# EAGLE board ModernWoodPCB (EAGLE 9.6.2), part 1 of 2
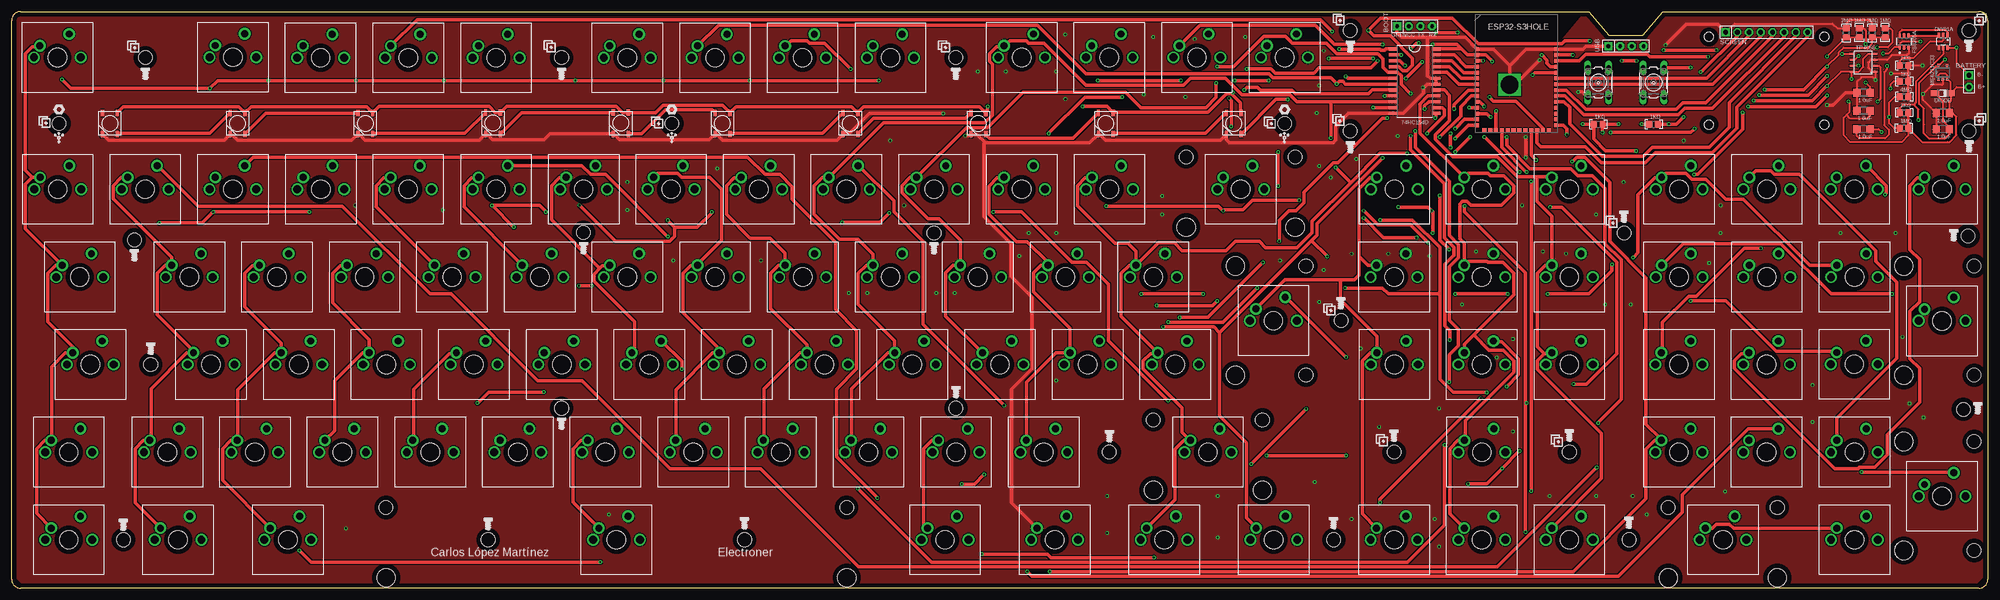
[diagram p2: board, top side]
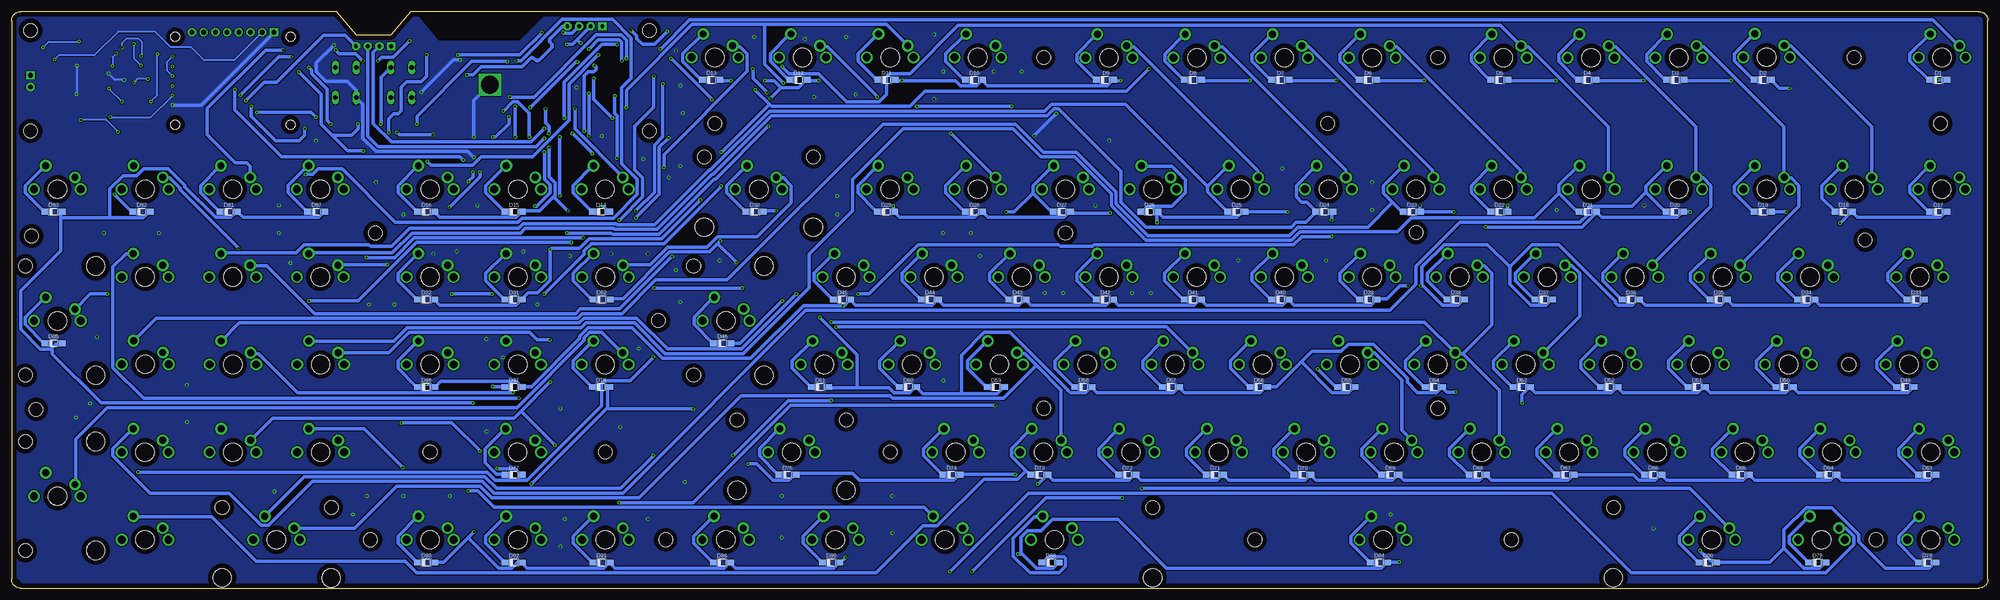
[diagram p3: board, bottom side, seen from below]

Size 428.5 x 125 mm. Coordinates in mm from the lower left corner, seen from the top.
Outline: 342,125 346.35,119.9 353.65,119.9 358,125 426.5,125 arc-90 428.5,123 428.5,2 arc-90 426.5,0 2,0 arc-90 0,2 0,123 arc-90 2,125 342,125
Copper layers (1*16): Top 0.035mm / dielectric 1.5mm / Bottom 0.035mm
Design rules "default *": minimum track width 15mil, minimum drill 0.35mm, track to track 8mil, track to pad 8mil, pad to pad 8mil, via to via 8mil, smd to smd 6mil, copper to edge 40mil, drill to drill 14mil, minimum pad ring 10mil, minimum via ring 8mil, stop-mask expansion 4mil, vias tented up to drill 14mil, thermal gap 10mil
Net classes: 0 default: width 0.203 mm
Holes 3 mm at 81.2,17.5 181.05,17.5 382.82,17.5 359.18,17.5 425.5,31.82 425.5,8.18 425.5,46.18 425.5,69.83 271.2,36.5 247.55,36.5 280.63,46.18 280.62,69.83 278.32,93.5 254.68,93.5 29,115 119.25,115 204.75,115 10.3,100.75 143.15,100.75 276,100.75 290.25,99.12 290.25,120.88 424.38,120.88 424.38,99.12 423.17,38.77 350.66,10.5 337.75,29.5 424.18,76.36 349.63,77 299.75,29.5 288.25,58 286.68,10.5 238,29.5 204.75,39 158.92,10.5 103.33,10.5 24.25,10.5 119.25,39 200,77 124,77.12 26.62,75.5 30.19,48.5
Holes 4 mm at 81.2,2.25 181.07,2.25 382.82,2.25 359.18,2.24 410.24,8.17 410.24,31.82 410.24,46.18 410.25,69.82 271.2,21.25 247.55,21.25 265.37,46.18 265.37,69.83 254.68,78.25 278.32,78.24
Holes 2 mm at 368,119.5 393,119.5 368,100.5 393,100.5
tKeepout: area 317.2,118.5 to 335.3,124.8
bKeepout: area 317.2,118.5 to 335.3,124.8

## Footprints (pad centres in the part's own frame; a part is rotated, then mirrored left to right if it is on the bottom)
SIP-100-02-40 = drill 1.016 pad 1.778 square: 1 -1.27,0 | drill 1.016 pad 1.778 octagon: 2 1.27,0
SIP-100-04-32 = drill 0.813 pad 1.778 square: 1 -3.81,0 | drill 0.813 pad 1.778 octagon: 2 -1.27,0; 3 1.27,0; 4 3.81,0
B3F-10XX = drill 1.016 long: 1 -3.251,2.261; 2 3.251,2.261; 3 -3.251,-2.261; 4 3.251,-2.261
1206 = smd 1.6 x 1.8: 1 -1.4,0; 2 1.4,0
SOD123FL = smd 1.8 x 1.25: A 1.7,0; C -1.7,0
CHERRY-MX = drill 1.714 pad 1.93: P$3 -5.08,0; P$4 5.08,0 | drill 1.5 pad 2.54: SW1 -3.81,2.54; SW2 2.54,5.08 | hole 4: 0,0
SOT95P280X145-6N = smd 1.21 x 0.59: 1 -1.255,0.95; 2 -1.255,0; 3 -1.255,-0.95; 4 1.255,-0.95; 5 1.255,0; 6 1.255,0.95
R-0805 = smd 1.3 x 1.5: 1 -0.95,0; 2 0.95,0
SIP-100-08-40 = drill 1.016 pad 1.778 square: 1 -8.89,0 | drill 1.016 pad 1.778 octagon: 2 -6.35,0; 3 -3.81,0; 4 -1.27,0; 5 1.27,0; 6 3.81,0; 7 6.35,0; 8 8.89,0
ESP32-S3HOLE = smd 0.838 x 0.889: 1 -8.581,5.254; 2 -8.581,3.984; 3 -8.581,2.714; 4 -8.581,1.444; 5 -8.581,0.174; 6 -8.581,-1.096; 7 -8.581,-2.366; 8 -8.581,-3.636; 9 -8.581,-4.906; 10 -8.581,-6.176; 11 -8.581,-7.446; 12 -8.581,-8.716; 13 -8.581,-9.986; 14 -8.581,-11.256; 27 8.581,-11.256; 28 8.581,-9.986; 29 8.581,-8.716; 30 8.581,-7.446; 31 8.581,-6.176; 32 8.581,-4.906; 33 8.581,-3.636; 34 8.581,-2.366; 35 8.581,-1.096; 36 8.581,0.174; 37 8.581,1.444; 38 8.581,2.714; 39 8.581,3.984; 40 8.581,5.254 | smd 0.889 x 0.838: 15 -6.985,-12.331; 16 -5.715,-12.331; 17 -4.445,-12.331; 18 -3.175,-12.331; 19 -1.905,-12.331; 20 -0.635,-12.331; 21 0.635,-12.331; 22 1.905,-12.331; 23 3.175,-12.331; 24 4.445,-12.331; 25 5.715,-12.331; 26 6.985,-12.331 | drill 3.81 pad 4.191 square: 41 -1.499,-2.464
ME6211C33M5G = smd 0.953 x 0.559: 1 -1.378,0.94; 2 -1.378,0; 3 -1.378,-0.94; 4 1.378,-0.94; 5 1.378,0.94
WS2812B5050 = smd 1.422 x 0.711: LED_DI 4.8,4.1; LED_DO 0.2,0.9; LED_GND 4.8,0.9; LED_VDD 0.2,4.1
74HC154D = smd 2.05 x 0.6: 1 -4.655,6.985; 2 -4.655,5.715; 3 -4.655,4.445; 4 -4.655,3.175; 5 -4.655,1.905; 6 -4.655,0.635; 7 -4.655,-0.635; 8 -4.655,-1.905; 9 -4.655,-3.175; 10 -4.655,-4.445; 11 -4.655,-5.715; 12 -4.655,-6.985; 13 4.655,-6.985; 14 4.655,-5.715; 15 4.655,-4.445; 16 4.655,-3.175; 17 4.655,-1.905; 18 4.655,-0.635; 19 4.655,0.635; 20 4.655,1.905; 21 4.655,3.175; 22 4.655,4.445; 23 4.655,5.715; 24 4.655,6.985
SOT23-8 = smd 0.42 x 0.835: 1 -1.905,-2.58; 2 -0.635,-2.58; 3 0.635,-2.58; 4 1.905,-2.58; 5 1.905,2.58; 6 0.635,2.58; 7 -0.635,2.58; 8 -1.905,2.58
SOT23-6 = smd 0.55 x 1.2: 1 -0.95,-1.3; 2 0,-1.3; 3 0.95,-1.3; 4 0.95,1.3; 5 0,1.3; 6 -0.95,1.3

## Placement (x,y rotation side)
BATTERY  F-1X02-SIP-100-40  [SIP-100-02-40]  424.4,109.9 270 top
BOOT  BOOT  [SIP-100-04-32]  304.2,121.8 0 top
BUTTON  1  [B3F-10XX]  344,109.6 90 top
BUTTON1  1  [B3F-10XX]  356,109.6 90 top
C1  1.0uF  [1206]  401.5,103.5 180 top
C2  1.0uF  [1206]  401.5,99.5 180 top
C3  1.0uF  [1206]  418.7,103 180 top
C4  1.0uF  [1206]  401.5,107.4 180 top
C5  1.0uF  [1206]  418.7,99.5 180 top
D1  [SOD123FL]  10.8,110.2 0 bottom
D2  [SOD123FL]  48.8,110.2 0 bottom
D3  [SOD123FL]  67.8,110.2 0 bottom
D4  [SOD123FL]  86.9,110.2 0 bottom
D5  [SOD123FL]  105.9,110.2 0 bottom
D6  [SOD123FL]  134.4,110.2 0 bottom
D7  [SOD123FL]  153.4,110.2 0 bottom
D8  [SOD123FL]  172.4,110.2 0 bottom
D9  [SOD123FL]  191.4,110.2 0 bottom
D10  [SOD123FL]  219.8,110.2 0 bottom
D11  [SOD123FL]  238.8,110.2 0 bottom
D12  [SOD123FL]  257.9,110.2 0 bottom
D13  [SOD123FL]  276.8,110.2 0 bottom
D14  [SOD123FL]  300.7,81.6 0 bottom
D15  [SOD123FL]  319.6,81.6 0 bottom
D16  [SOD123FL]  338.6,81.6 0 bottom
D17  [SOD123FL]  10.8,81.6 0 bottom
D18  [SOD123FL]  31.3,81.6 0 bottom
D19  [SOD123FL]  48.8,81.6 0 bottom
D20  [SOD123FL]  67.9,81.6 0 bottom
D21  [SOD123FL]  86.8,81.6 0 bottom
D22  [SOD123FL]  105.9,81.6 0 bottom
D23  [SOD123FL]  124.9,81.6 0 bottom
D24  [SOD123FL]  143.9,81.6 0 bottom
D25  [SOD123FL]  162.9,81.6 0 bottom
D26  [SOD123FL]  181.8,81.6 0 bottom
D27  [SOD123FL]  200.8,81.6 0 bottom
D28  [SOD123FL]  219.8,81.6 0 bottom
D29  [SOD123FL]  238.9,81.6 0 bottom
D30  [SOD123FL]  267.4,81.6 0 bottom
D31  [SOD123FL]  319.6,62.6 0 bottom
D32  [SOD123FL]  338.6,62.6 0 bottom
D33  [SOD123FL]  15.6,62.6 0 bottom
D34  [SOD123FL]  39.4,62.6 0 bottom
D35  [SOD123FL]  58.4,62.6 0 bottom
D36  [SOD123FL]  77.4,62.6 0 bottom
D37  [SOD123FL]  96.3,62.6 0 bottom
D38  [SOD123FL]  115.4,62.6 0 bottom
D39  [SOD123FL]  134.3,62.6 0 bottom
D40  [SOD123FL]  153.4,62.6 0 bottom
D41  [SOD123FL]  172.4,62.6 0 bottom
D42  [SOD123FL]  191.4,62.6 0 bottom
D43  [SOD123FL]  210.4,62.6 0 bottom
D44  [SOD123FL]  229.4,62.6 0 bottom
D45  [SOD123FL]  248.4,62.6 0 bottom
D46  [SOD123FL]  274.4,53.1 0 bottom
D47  [SOD123FL]  319.6,43.6 0 bottom
D48  [SOD123FL]  338.6,43.6 0 bottom
D49  [SOD123FL]  17.9,43.6 0 bottom
D50  [SOD123FL]  44.1,43.6 0 bottom
D51  [SOD123FL]  63.1,43.6 0 bottom
D52  [SOD123FL]  82.1,43.6 0 bottom
D53  [SOD123FL]  101.1,43.6 0 bottom
D54  [SOD123FL]  120.1,43.6 0 bottom
D55  [SOD123FL]  139.1,43.6 0 bottom
D56  [SOD123FL]  158.1,43.6 0 bottom
D57  [SOD123FL]  177.1,43.6 0 bottom
D58  [SOD123FL]  196.1,43.6 0 bottom
D59  [SOD123FL]  215.1,43.6 0 bottom
D60  [SOD123FL]  234.1,43.6 0 bottom
D61  [SOD123FL]  253.2,43.6 0 bottom
D62  [SOD123FL]  300.6,62.6 0 bottom
D63  [SOD123FL]  13.2,24.6 0 bottom
D64  [SOD123FL]  34.6,24.6 0 bottom
D65  [SOD123FL]  53.6,24.6 0 bottom
D66  [SOD123FL]  72.6,24.6 0 bottom
D67  [SOD123FL]  91.6,24.6 0 bottom
D68  [SOD123FL]  110.6,24.6 0 bottom
D69  [SOD123FL]  129.6,24.6 0 bottom
D70  [SOD123FL]  148.6,24.6 0 bottom
D71  [SOD123FL]  167.6,24.6 0 bottom
D72  [SOD123FL]  186.6,24.6 0 bottom
D73  [SOD123FL]  205.6,24.6 0 bottom
D74  [SOD123FL]  224.7,24.6 0 bottom
D75  [SOD123FL]  260.3,24.6 0 bottom
D76  [SOD123FL]  300.7,43.6 0 bottom
D77  [SOD123FL]  319.6,24.6 0 bottom
D78  [SOD123FL]  13.2,5.6 0 bottom
D79  [SOD123FL]  37,5.6 0 bottom
D80  [SOD123FL]  60.7,5.6 0 bottom
D81  [SOD123FL]  381.4,81.6 0 bottom
D82  [SOD123FL]  400.3,81.6 0 bottom
D83  [SOD123FL]  419.4,81.6 0 bottom
D84  [SOD123FL]  132,5.6 0 bottom
D85  [SOD123FL]  419.4,53.1 0 bottom
D86  [SOD123FL]  274.5,5.6 0 bottom
D87  [SOD123FL]  362.4,81.6 0 bottom
D88  [SOD123FL]  203.2,5.6 0 bottom
D90  [SOD123FL]  250.8,5.6 0 bottom
D91  [SOD123FL]  300.6,5.6 0 bottom
D92  [SOD123FL]  319.6,5.6 0 bottom
D93  [SOD123FL]  338.6,5.6 0 bottom
DIODE  [SOD123FL]  418.7,107.3 180 top
DUPLICADO1  CHERRY-MX  [CHERRY-MX]  361.5,29.5 0 top
DUPLICADO2  CHERRY-MX  [CHERRY-MX]  380.5,29.5 0 top
DUPLICADO3  CHERRY-MX  [CHERRY-MX]  399.55,29.5 0 top
DUPLICADO4  CHERRY-MX  [CHERRY-MX]  361.5,48.5 0 top
DUPLICADO5  CHERRY-MX  [CHERRY-MX]  380.5,48.5 0 top
DUPLICADO6  CHERRY-MX  [CHERRY-MX]  399.5,48.55 0 top
DUPLICADO7  CHERRY-MX  [CHERRY-MX]  361.55,67.45 0 top
DUPLICADO8  CHERRY-MX  [CHERRY-MX]  380.55,67.45 0 top
DUPLICADO9  CHERRY-MX  [CHERRY-MX]  399.55,67.45 0 top
DUPLICADO10  CHERRY-MX  [CHERRY-MX]  371.05,10.5 0 top
ENTERDUPLICADO  CHERRY-MX  [CHERRY-MX]  418.55,19.95 0 top
FN_KEY  CHERRY-MX  [CHERRY-MX]  226.15,10.5 0 top
PUNTODUPLICADO  CHERRY-MX  [CHERRY-MX]  399.55,10.5 0 top
Q2  FS8205  [SOT95P280X145-6N]  410.33,118.5 90 top
R1  1K  [R-0805]  410.3,109.9 0 top
R2  1K  [R-0805]  410.3,103.1 0 top
R3  1K  [R-0805]  410.3,113.3 0 top
R4  1K  [R-0805]  344,100.6 0 top
R5  1M  [R-0805]  410.3,99.7 180 top
R6  4M  [R-0805]  410.3,106.5 0 top
R7  1K  [R-0805]  356,100.6 0 top
R8  1M  [R-0805]  400.6,120.4 270 top
R9  2M  [R-0805]  397.8,120.4 90 top
R10  1M  [R-0805]  406.2,120.4 270 top
R11  2M  [R-0805]  403.4,120.4 90 top
SCREEN  F-1X08-SIP-100-40  [SIP-100-08-40]  380.5,120.5 0 top
U1  ESP32-S3HOLE  [ESP32-S3HOLE]  326.3,111.6 0 top
U2  ME6211C33M5G  [ME6211C33M5G]  418.7,111.8 90 top
U$1  CHERRY-MX  [CHERRY-MX]  12.41,10.49 0 top
U$2  CHERRY-MX  [CHERRY-MX]  12.4,29.5 0 top
U$3  CHERRY-MX  [CHERRY-MX]  17.1,48.5 0 top
U$4  CHERRY-MX  [CHERRY-MX]  14.8,67.45 0 top
U$5  CHERRY-MX  [CHERRY-MX]  10,86.5 0 top
U$6  CHERRY-MX  [CHERRY-MX]  9.95,115.05 0 top
U$7  CHERRY-MX  [CHERRY-MX]  36.1,10.5 0 top
U$8  CHERRY-MX  [CHERRY-MX]  33.8,29.5 0 top
U$9  CHERRY-MX  [CHERRY-MX]  43.25,48.5 0 top
U$10  CHERRY-MX  [CHERRY-MX]  38.55,67.45 0 top
U$11  CHERRY-MX  [CHERRY-MX]  29,86.5 0 top
U$12  CHERRY-MX  [CHERRY-MX]  48,115.1 0 top
U$13  CHERRY-MX  [CHERRY-MX]  59.9,10.5 0 top
U$14  CHERRY-MX  [CHERRY-MX]  52.75,29.5 0 top
U$15  CHERRY-MX  [CHERRY-MX]  62.3,48.5 0 top
U$16  CHERRY-MX  [CHERRY-MX]  57.55,67.45 0 top
U$17  CHERRY-MX  [CHERRY-MX]  48,86.5 0 top
U$18  CHERRY-MX  [CHERRY-MX]  67,115 0 top
U$19  CHERRY-MX  [CHERRY-MX]  380.55,86.5 0 top
U$20  CHERRY-MX  [CHERRY-MX]  71.75,29.5 0 top
U$21  CHERRY-MX  [CHERRY-MX]  81.3,48.5 0 top
U$22  CHERRY-MX  [CHERRY-MX]  76.55,67.45 0 top
U$23  CHERRY-MX  [CHERRY-MX]  67.05,86.5 0 top
U$24  CHERRY-MX  [CHERRY-MX]  86.05,115 0 top
U$25  CHERRY-MX  [CHERRY-MX]  399.5,86.5 0 top
U$26  CHERRY-MX  [CHERRY-MX]  90.8,29.5 0 top
U$27  CHERRY-MX  [CHERRY-MX]  100.25,48.5 0 top
U$28  CHERRY-MX  [CHERRY-MX]  95.5,67.45 0 top
U$29  CHERRY-MX  [CHERRY-MX]  86,86.5 0 top
U$30  CHERRY-MX  [CHERRY-MX]  105.05,115 0 top
U$31  CHERRY-MX  [CHERRY-MX]  418.55,86.5 0 top
U$32  CHERRY-MX  [CHERRY-MX]  109.75,29.5 0 top
U$33  CHERRY-MX  [CHERRY-MX]  119.3,48.5 0 top
U$34  CHERRY-MX  [CHERRY-MX]  114.55,67.45 0 top
U$35  CHERRY-MX  [CHERRY-MX]  105.05,86.5 0 top
U$36  CHERRY-MX  [CHERRY-MX]  133.5,115 0 top
U$37  CHERRY-MX  [CHERRY-MX]  131.15,10.5 0 top
U$38  CHERRY-MX  [CHERRY-MX]  128.75,29.5 0 top
U$39  CHERRY-MX  [CHERRY-MX]  138.3,48.5 0 top
U$40  CHERRY-MX  [CHERRY-MX]  133.5,67.45 0 top
U$41  CHERRY-MX  [CHERRY-MX]  124.05,86.5 0 top
U$42  CHERRY-MX  [CHERRY-MX]  152.55,115 0 top
U$43  CHERRY-MX  [CHERRY-MX]  418.55,57.95 0 top
U$44  CHERRY-MX  [CHERRY-MX]  147.8,29.5 0 top
U$45  CHERRY-MX  [CHERRY-MX]  157.25,48.5 0 top
U$46  CHERRY-MX  [CHERRY-MX]  152.55,67.45 0 top
U$47  CHERRY-MX  [CHERRY-MX]  143,86.5 0 top
U$48  CHERRY-MX  [CHERRY-MX]  171.5,115 0 top
U$49  CHERRY-MX  [CHERRY-MX]  273.65,10.5 0 top
U$50  CHERRY-MX  [CHERRY-MX]  166.8,29.5 0 top
U$51  CHERRY-MX  [CHERRY-MX]  176.25,48.5 0 top
U$52  CHERRY-MX  [CHERRY-MX]  171.55,67.45 0 top
U$53  CHERRY-MX  [CHERRY-MX]  162,86.5 0 top
U$54  CHERRY-MX  [CHERRY-MX]  190.55,115 0 top
U$55  CHERRY-MX  [CHERRY-MX]  361.55,86.5 0 top
U$56  CHERRY-MX  [CHERRY-MX]  185.8,29.5 0 top
U$57  CHERRY-MX  [CHERRY-MX]  195.3,48.5 0 top
U$58  CHERRY-MX  [CHERRY-MX]  190.55,67.45 0 top
U$59  CHERRY-MX  [CHERRY-MX]  181,86.5 0 top
U$60  CHERRY-MX  [CHERRY-MX]  219,115.05 0 top
U$61  CHERRY-MX  [CHERRY-MX]  202.4,10.5 0 top
U$62  CHERRY-MX  [CHERRY-MX]  204.75,29.5 0 top
U$63  CHERRY-MX  [CHERRY-MX]  214.3,48.5 0 top
U$64  CHERRY-MX  [CHERRY-MX]  209.5,67.45 0 top
U$65  CHERRY-MX  [CHERRY-MX]  200,86.5 0 top
U$66  CHERRY-MX  [CHERRY-MX]  238,115.05 0 top
U$67  WS2812B5050  [WS2812B5050]  262.5,103.25 270 top
U$68  CHERRY-MX  [CHERRY-MX]  223.8,29.5 0 top
U$69  CHERRY-MX  [CHERRY-MX]  233.3,48.5 0 top
U$70  CHERRY-MX  [CHERRY-MX]  228.5,67.45 0 top
U$71  CHERRY-MX  [CHERRY-MX]  219,86.5 0 top
U$72  CHERRY-MX  [CHERRY-MX]  257,115.05 0 top
U$73  CHERRY-MX  [CHERRY-MX]  249.9,10.5 0 top
U$74  CHERRY-MX  [CHERRY-MX]  259.4,29.5 0 top
U$75  CHERRY-MX  [CHERRY-MX]  252.3,48.5 0 top
U$76  CHERRY-MX  [CHERRY-MX]  247.55,67.45 0 top
U$77  CHERRY-MX  [CHERRY-MX]  238.05,86.5 0 top
U$78  CHERRY-MX  [CHERRY-MX]  276,115.05 0 top
U$79  CHERRY-MX  [CHERRY-MX]  299.75,10.5 0 top
U$80  CHERRY-MX  [CHERRY-MX]  299.8,48.5 0 top
U$81  CHERRY-MX  [CHERRY-MX]  299.75,67.45 0 top
U$82  CHERRY-MX  [CHERRY-MX]  273.6,58 0 top
U$83  CHERRY-MX  [CHERRY-MX]  266.5,86.5 0 top
U$84  CHERRY-MX  [CHERRY-MX]  299.8,86.5 0 top
U$85  CHERRY-MX  [CHERRY-MX]  318.75,10.5 0 top
U$86  CHERRY-MX  [CHERRY-MX]  318.8,29.5 0 top
U$87  CHERRY-MX  [CHERRY-MX]  318.75,48.5 0 top
U$88  CHERRY-MX  [CHERRY-MX]  318.75,67.45 0 top
U$89  CHERRY-MX  [CHERRY-MX]  318.75,86.5 0 top
U$90  CHERRY-MX  [CHERRY-MX]  337.75,10.5 0 top
U$91  CHERRY-MX  [CHERRY-MX]  337.75,48.5 0 top
U$92  CHERRY-MX  [CHERRY-MX]  337.75,67.45 0 top
U$93  CHERRY-MX  [CHERRY-MX]  337.75,86.5 0 top
U$94  74HC154D  [74HC154D]  304.2,109.9 0 top
U$95  TP4056  [SOT23-8]  401.5,113.9 90 top
U$96  DW01A  [SOT23-6]  418.8,118.5 180 top
U$97  WS2812B5050  [WS2812B5050]  234.75,103.25 270 top
U$98  WS2812B5050  [WS2812B5050]  207.1,103.25 270 top
U$99  WS2812B5050  [WS2812B5050]  179.35,103.25 270 top
U$100  WS2812B5050  [WS2812B5050]  151.65,103.25 270 top
U$101  WS2812B5050  [WS2812B5050]  129.6,103.3 270 top
U$102  WS2812B5050  [WS2812B5050]  101.9,103.3 270 top
U$103  WS2812B5050  [WS2812B5050]  74.2,103.25 270 top
U$104  WS2812B5050  [WS2812B5050]  46.5,103.25 270 top
U$105  WS2812B5050  [WS2812B5050]  18.8,103.25 270 top
USB  F-1X04-SIP-100-32  [SIP-100-04-32]  350,117.5 0 top